# Altium schematic sheet Solar-Charger.SchDoc
size A4
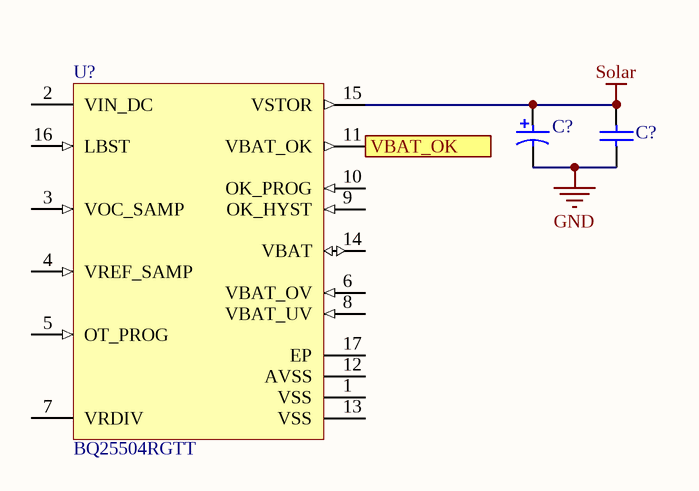
[diagram p0: Solar-Charger.SchDoc]

## Parts
(Parts that share a designator on the sheet are numbered #1, #2 ... from top to bottom, then left to right.)
C?#1  UUD0J101MCL1GS  [NIC-CAPA2-6.3X5.8_V]  (value not drawn)
C?#2  C0603C104K9RACTU  [CAPC1608X87X35NL15T15]  (value not drawn)
U?  BQ25504RGTT  [RGT0016C_V]

## Ports
VBAT_OK (out)

## Nets
GND: C?#1.2 C?#2.1
Solar: C?#1.1 C?#2.2 U?.15(VSTOR)
VBAT_OK: U?.11(VBAT_OK) ; port VBAT_OK

Not connected (* = marked no-connect by the designer): U? 1(VSS) 2(VIN_DC) 3(VOC_SAMP) 4(VREF_SAMP) 5(OT_PROG) 6(VBAT_OV) 7(VRDIV) 8(VBAT_UV) 9(OK_HYST) 10(OK_PROG) 12(AVSS) 13(VSS) 14(VBAT) 16(LBST) 17(EP)

## Library data of the parts
C?#1 = CMP-0687-00053-1: Aluminum Electrolytic Capacitor, UD Series, Low Impedance, 100 uF, 6.3 V, + / - 20%, -55 to 105 degC, Chip Type, 6.3 x 5.8 mm D x L, Pb-Free, Reel; Manufacturer: Nichicon; Endurance Time: 2000 h; Rated Ripple Current (at 100kHz): 230 mA; Tolerance Rated Capacitance: -20 to 20%; Packing: Dia382mm Reel; Rated Voltage: 6.3 V; Rated Capacitance: 100 uF; Impedance: 0.44 Ohm; Length: 5.8 mm; ComponentLink3URL: http://products.nichicon.co.jp/en/pdf/XJA043/e-ud.pdf; RoHS: TRUE; ComponentLink2Description: Datasheet; ComponentLink2URL: http://products.nichicon.co.jp/en/pdf/XJA043/e-ud.pdf; ComponentLink3Description: Package Specification; PackageDescription: 2-Pin Surface Mount Device, Diameter 6.3 mm, Height 5.8 mm, Pitch 5.4 mm; DatasheetVersion: 08/2012; ComponentLink1Description: Manufacturer URL; Mounting Technology: Surface Mount; ComponentLink1URL: http://www.nichicon.co.jp/; Diameter: 6.3 mm; PartNumber: UUD0J101MCL1GS; PackageReference: CAPAE-D6.3H5.8
C?#2 = CMP-2006-03832-1: Manufacturer: Kemet; Part Number: C0603C104K9RACTU
U? = CMP-0321-00258-2: Ultra Low Power Boost Converter with Battery Management for Energy Harvester App, 0.13 V, -40 to 85 degC, 16-pin QFN (RGT), Green (RoHS & no Sb/Br); Manufacturer: Texas Instruments; Li-Ion: N; SubFamily: Battery Charge Management; Vin(Min)(V): 0.13; ComponentLink1URL: http://www.ti.com/general/docs/lit/getliterature.tsp?genericPartNumber=BQ25504&fileType=pdf; ComponentLink1Description: Datasheet; PartNumber: BQ25504RGTT; DatasheetVersion: SLUSAH0; PackageVersion: revH, Oct-2011; Lead Acid: N; PackageDescription: 16-Pin Plastic Quad Flat No-Lead, 3 x 3 mm Body, 0.5 mm Pitch, 1.7 x 1.7 mm Exposed Pad; Mounting Technology: Surface Mount; Eco-Plan: Green (RoHS & no Sb/Br); NiMH: N; PackageReference: RGT0016C; Over Voltage Protection: N; Li-Polymer: N; NiCd: N; Code_JEDEC: MO-220